# EAGLE design tsshield (EAGLE 6.4)
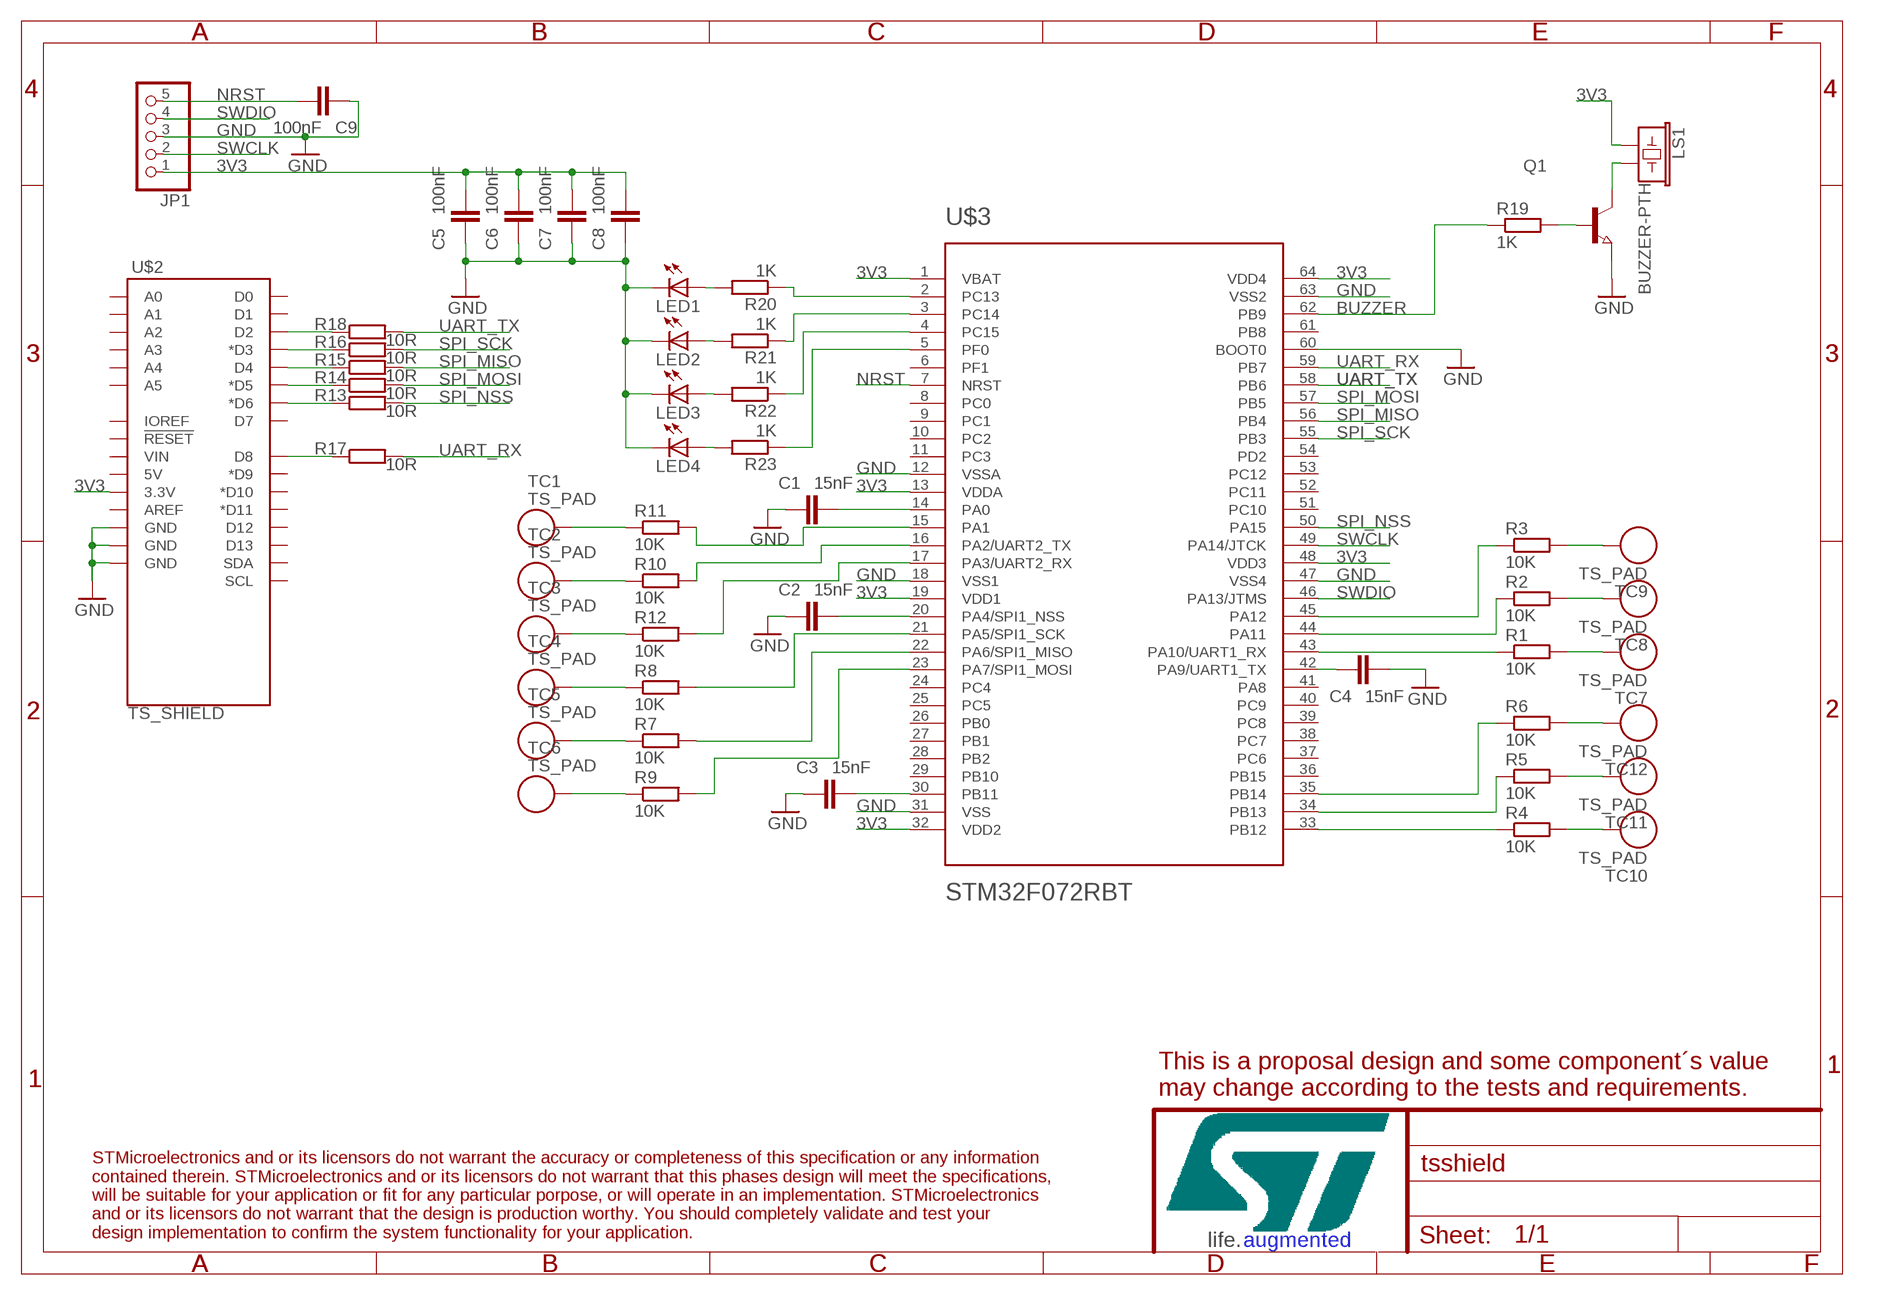
[diagram p0: schematic, sheet 1]

## Parts
C1  15nF  CC0603  [C0603]
C2  15nF  CC0603  [C0603]
C3  15nF  CC0603  [C0603]
C4  15nF  CC0603  [C0603]
C5  100nF  CC0603  [C0603]
C6  100nF  CC0603  [C0603]
C7  100nF  CC0603  [C0603]
C8  100nF  CC0603  [C0603]
C9  100nF  CC0603  [C0603]
JP1  PINHD-1X5  [1X05]
LED1  LED_E  [LED_1206]
LED2  LED_E  [LED_1206]
LED3  LED_E  [LED_1206]
LED4  LED_E  [LED_1206]
LS1  BUZZER-PTH  [BUZZER-12MM]
Q1  NPN-TRANSISTOR_SOT23  [SOT23]
R1  10K  RR0603  [R0603]
R2  10K  RR0603  [R0603]
R3  10K  RR0603  [R0603]
R4  10K  RR0603  [R0603]
R5  10K  RR0603  [R0603]
R6  10K  RR0603  [R0603]
R7  10K  RR0603  [R0603]
R8  10K  RR0603  [R0603]
R9  10K  RR0603  [R0603]
R10  10K  RR0603  [R0603]
R11  10K  RR0603  [R0603]
R12  10K  RR0603  [R0603]
R13  10R  RR0603  [R0603]
R14  10R  RR0603  [R0603]
R15  10R  RR0603  [R0603]
R16  10R  RR0603  [R0603]
R17  10R  RR0603  [R0603]
R18  10R  RR0603  [R0603]
R19  1K  RR0603  [R0603]
R20  1K  RR0603  [R0603]
R21  1K  RR0603  [R0603]
R22  1K  RR0603  [R0603]
R23  1K  RR0603  [R0603]
TC1  TS_PAD  [TS_PAD]
TC2  TS_PAD  [TS_PAD]
TC3  TS_PAD  [TS_PAD]
TC4  TS_PAD  [TS_PAD]
TC5  TS_PAD  [TS_PAD]
TC6  TS_PAD  [TS_PAD]
TC7  TS_PAD  [TS_PAD]
TC8  TS_PAD  [TS_PAD]
TC9  TS_PAD  [TS_PAD]
TC10  TS_PAD  [TS_PAD]
TC11  TS_PAD  [TS_PAD]
TC12  TS_PAD  [TS_PAD]
U$2  TS_SHIELD  [TS_SHIELD]
U$3  STM32F072RBT  [TQFP64]

## Nets
3V3: C5.1 C6.1 C7.1 C8.1 JP1.1 LS1.+ U$2.3.3V U$3.1(VBAT) U$3.13(VDDA) U$3.19(VDD1) U$3.32(VDD2) U$3.48(VDD3) U$3.64(VDD4)
BUZZER: R19.1 U$3.62(PB9)
GND: C1.2 C2.2 C3.2 C4.1 C5.2 C6.2 C7.2 C8.2 C9.2 JP1.3 LED1.C LED2.C LED3.C LED4.C Q1.2(E) U$2.GND@1(GND) U$2.GND@2(GND) U$2.GND@3(GND) U$3.12(VSSA) U$3.18(VSS1) U$3.31(VSS) U$3.47(VSS4) U$3.60(BOOT0) U$3.63(VSS2)
N$1: C1.1 U$3.14(PA0)
N$2: C2.1 U$3.20(PA4/SPI1_NSS)
N$3: C3.1 U$3.30(PB11)
N$4: C4.2 U$3.42(PA9/UART1_TX)
N$5: R11.2 U$3.15(PA1)
N$6: R10.2 U$3.16(PA2/UART2_TX)
N$7: R12.2 U$3.17(PA3/UART2_RX)
N$8: R8.2 U$3.21(PA5/SPI1_SCK)
N$9: R7.1 TC5.1
N$10: R9.2 U$3.23(PA7/SPI1_MOSI)
N$11: R4.1 U$3.33(PB12)
N$12: R5.1 U$3.34(PB13)
N$13: R6.1 U$3.35(PB14)
N$14: R1.1 U$3.43(PA10/UART1_RX)
N$15: R2.1 U$3.44(PA11)
N$16: R3.1 U$3.45(PA12)
N$17: R15.1 U$2.D4
N$18: R14.1 U$2.D5(*D5)
N$19: R13.1 U$2.D6(*D6)
N$20: R16.1 U$2.D3(*D3)
N$21: R11.1 TC1.1
N$22: R10.1 TC2.1
N$23: R12.1 TC3.1
N$24: R8.1 TC4.1
N$25: R7.2 U$3.22(PA6/SPI1_MISO)
N$26: R9.1 TC6.1
N$27: R4.2 TC10.1
N$28: R5.2 TC11.1
N$29: R6.2 TC12.1
N$30: R1.2 TC7.1
N$31: R2.2 TC8.1
N$32: R3.2 TC9.1
N$37: R18.1 U$2.D2
N$40: R17.1 U$2.D8
N$41: LS1.- Q1.3(C)
N$42: Q1.1(B) R19.2
N$43: LED2.A R21.2
N$44: LED1.A R20.2
N$45: LED3.A R22.2
N$46: LED4.A R23.2
N$47: R20.1 U$3.2(PC13)
N$48: R21.1 U$3.3(PC14)
N$50: R22.1 U$3.4(PC15)
N$51: R23.1 U$3.5(PF0)
NRST: C9.1 JP1.5 U$3.7(NRST)
SPI_MISO: R15.2 U$3.56(PB4)
SPI_MOSI: R14.2 U$3.57(PB5)
SPI_NSS: R13.2 U$3.50(PA15)
SPI_SCK: R16.2 U$3.55(PB3)
SWCLK: JP1.2 U$3.49(PA14/JTCK)
SWDIO: JP1.4 U$3.46(PA13/JTMS)
UART_RX: R17.2 U$3.59(PB7)
UART_TX: R18.2 U$3.58(PB6)
Unconnected: U$2.5V U$2.A0 U$2.A1 U$2.A2 U$2.A3 U$2.A4 U$2.A5 U$2.AREF U$2.D0 U$2.D1 U$2.D7 U$2.D9(*D9) U$2.D10(*D10) U$2.D11(*D11) U$2.D12 U$2.D13 U$2.IOREF U$2.RESET@1(!RESET!) U$2.SCL U$2.SDA U$2.VIN U$3.6(PF1) U$3.8(PC0) U$3.9(PC1) U$3.10(PC2) U$3.11(PC3) U$3.24(PC4) U$3.25(PC5) U$3.26(PB0) U$3.27(PB1) U$3.28(PB2) U$3.29(PB10) U$3.36(PB15) U$3.37(PC6) U$3.38(PC7) U$3.39(PC8) U$3.40(PC9) U$3.41(PA8) U$3.51(PC10) U$3.52(PC11) U$3.53(PC12) U$3.54(PD2) U$3.61(PB8)

## Library data of the parts
C1-C9 = eagle-ltspice:C: CAPACITOR, European symbol; SPICEMODEL: NONE; SPICEPREFIX: C
JP1 = pinhead:PINHD-1X5: PIN HEADER
LED1-LED4 = eagle-ltspice:LED_E: LED Source: http://www.osram.convergy.de Source: www.luxeon.com Source: www.kingbright.com; SPICEMODEL: NONE; SPICEPREFIX: D; SPICETYPE: diode
LS1 = SparkFun-Electromechanical:BUZZER: Buzzer Small round buzzers that operate around the audible 2kHz range. You can use these as speakers to create simple music or user interfaces. Variant Overview: PTH - Mini Speaker - PC Mount 12mm 2.048kHz <https://www.sparkfun.com/products/7950> PTH_KIT - Mini Speaker - PC Mount 12mm 2.048kHz <https://www.sparkfun.com/products/7950> KIT simplifies soldering by adding stop mask to one side of the pads. PTH_NO_SILK - Mini Speaker - PC Mount 12mm 2.048kHz <https://www.sparkfun.com/products/7950> No silkscreen indicator of buzzer outline. PTH_KIT_NO_SILK - Mini Speaker - PC Mount 12mm 2.048kHz <https://www.sparkfun.com/products/7950> KIT package w/o silkscreen SMD - Buzzer Audio Magnetic (CCV-084B16) SMD buzzer used on, e.g. the LilyPad Buzzer <https://www.sparkfun.com/products/8463> and RFID USB Reader <https://www.sparkfun.com/products/9963>. SMD_KIT - Buzzer Audio Magnetic (CCV-084B16) SMD Buzzer with elongated pins to make soldering easier. Used on the SparkFun Simon Says - Surface Mount Soldering Kit <https://www.sparkfun.com/products/10935>.; PROD_ID: COMP-08253; SF_SKU: COM-07950
Q1 = semicon-smd-ipc:NPN-TRANSISTOR_: NPN TRANSISTOR
R1-R23 = eagle-ltspice:R: RESISTOR, European symbol; SPICEMODEL: NONE; SPICEPREFIX: R
TC1-TC12 = GPRC_Misc:TS_PAD
U$2 = SparkFun-Boards:TS_SHIELD
U$3 = SparkFun-IC-Microcontroller:STM32F072RBT

## Board
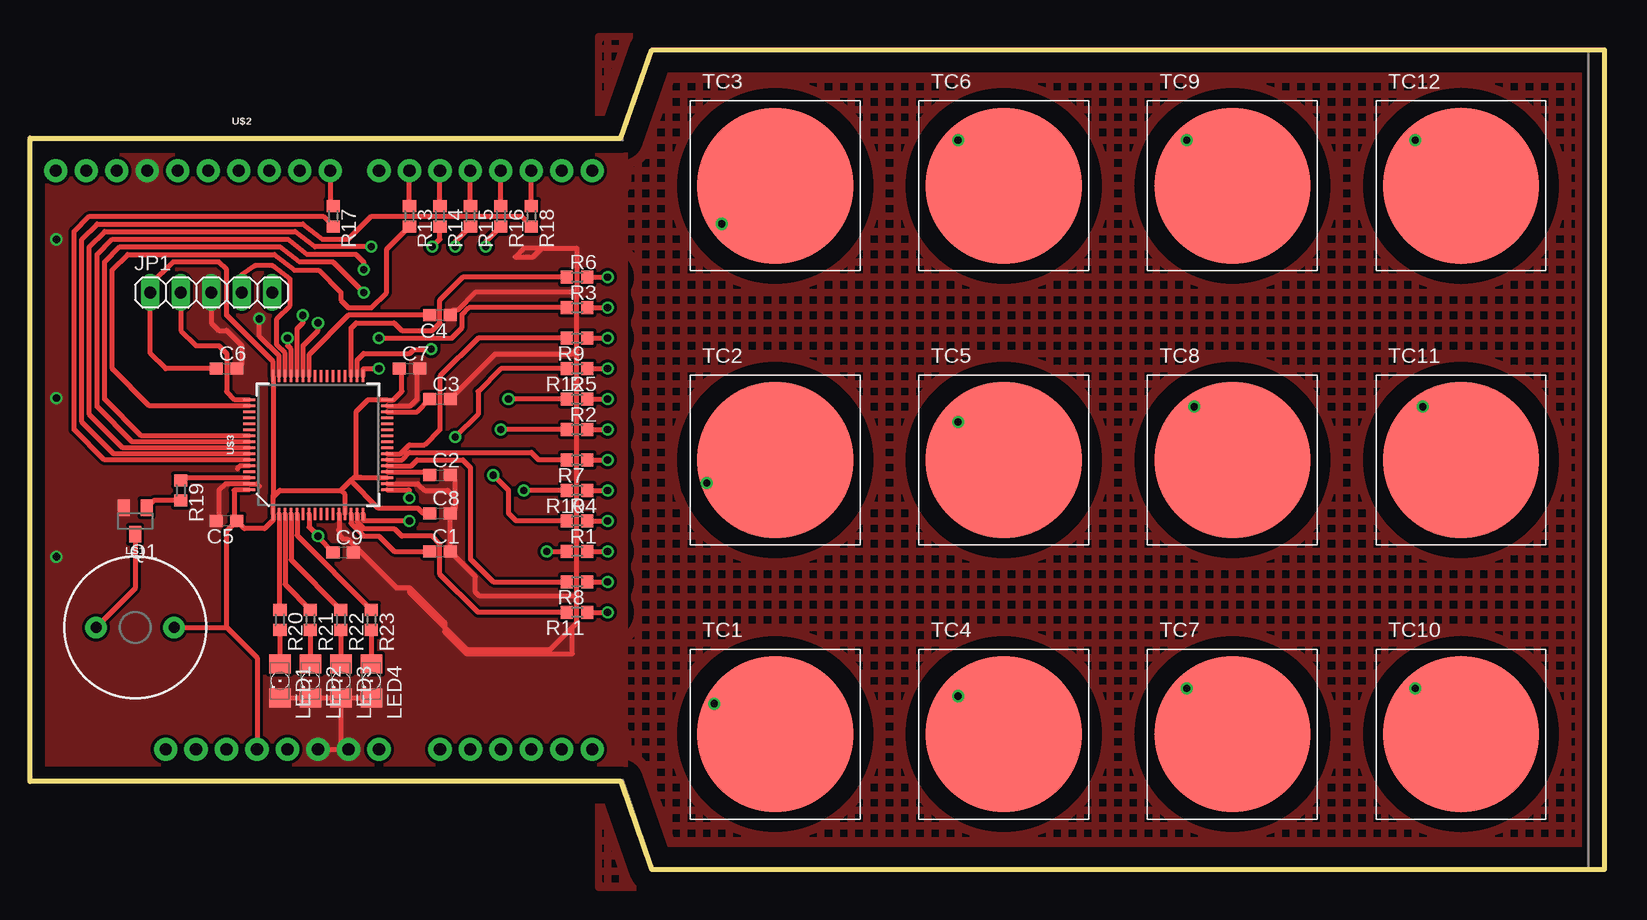
[diagram p1: board, top side]
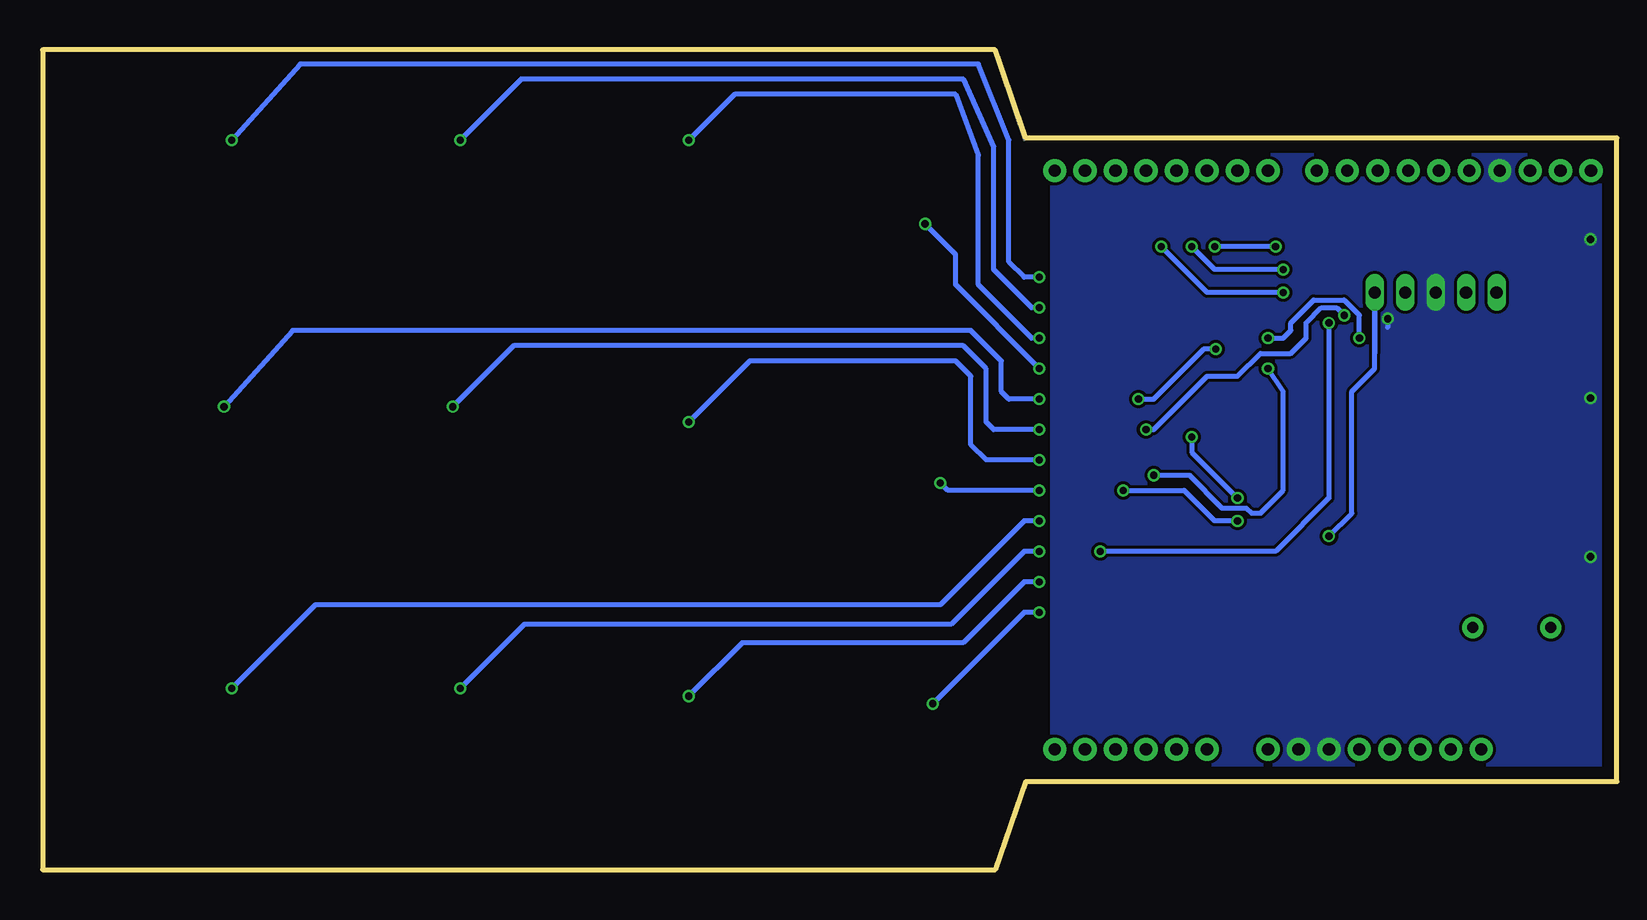
[diagram p2: board, bottom side, seen from below]

Size 131.2 x 68.35 mm. Coordinates in mm from the lower left corner, seen from the top.
Outline: 0,61.01 49.24,61.01 51.82,68.35 131.2,68.35 131.2,0 51.82,0 49.24,7.35 0,7.35 0,61.01
Copper layers (1*16): Top 0.035mm / dielectric 1.5mm / Bottom 0.035mm
Design rules "default": minimum track width 10mil, minimum drill 24mil, track to track 8mil, track to pad 8mil, pad to pad 8mil, via to via 8mil, smd to smd 8mil, copper to edge 40mil, drill to drill 8mil, minimum pad ring 10mil, minimum via ring 8mil, stop-mask expansion 4mil, vias tented up to drill 0mil, thermal gap 10mil

### Footprints (pad centres in the part's own frame; a part is rotated, then mirrored left to right if it is on the bottom)
C0603 = smd 1.1 x 1: 1 -0.85,0; 2 0.85,0
1X05 = drill 1.016 long: 1 -5.08,0; 2 -2.54,0; 3 0,0; 4 2.54,0; 5 5.08,0
LED_1206 = smd 1.6 x 1.803: A -1.422,0; C 1.422,0
BUZZER-12MM = drill 0.9 pad 1.778: + 3.25,0; - -3.25,0
SOT23 = smd 1 x 1.4: 1 -0.95,-1.1; 2 0.95,-1.1; 3 0,1.1
R0603 = smd 1 x 1.1: 1 -0.85,0; 2 0.85,0
TS_PAD = smd 13 x 13: 1 0,0
TS_SHIELD = drill 1.016 pad 1.93: 3.3V 19.05,2.54; 5V 21.59,2.54; A0 34.29,2.54; A1 36.83,2.54; A2 39.37,2.54; A3 41.91,2.54; A4 44.45,2.54; A5 46.99,2.54; AREF 7.366,50.8; D0 46.99,50.8; D1 44.45,50.8; D2 41.91,50.8; D3 39.37,50.8; D4 36.83,50.8; D5 34.29,50.8; D6 31.75,50.8; D7 29.21,50.8; D8 25.146,50.8; D9 22.606,50.8; D10 20.066,50.8; D11 17.526,50.8; D12 14.986,50.8; D13 12.446,50.8; GND@1 24.13,2.54; GND@2 26.67,2.54; GND@3 9.906,50.8; IOREF 13.97,2.54; NC 11.43,2.54; RESET@1 16.51,2.54; SCL 2.286,50.8; SDA 4.826,50.8; VIN 29.21,2.54
TQFP64 = smd 0.22 x 1: 1 -3.75,-5.75; 2 -3.25,-5.75; 3 -2.75,-5.75; 4 -2.25,-5.75; 5 -1.75,-5.75; 6 -1.25,-5.75; 7 -0.75,-5.75; 8 -0.25,-5.75; 9 0.25,-5.75; 10 0.75,-5.75; 11 1.25,-5.75; 12 1.75,-5.75; 13 2.25,-5.75; 14 2.75,-5.75; 15 3.25,-5.75; 16 3.75,-5.75; 33 3.75,5.75; 34 3.25,5.75; 35 2.75,5.75; 36 2.25,5.75; 37 1.75,5.75; 38 1.25,5.75; 39 0.75,5.75; 40 0.25,5.75; 41 -0.25,5.75; 42 -0.75,5.75; 43 -1.25,5.75; 44 -1.75,5.75; 45 -2.25,5.75; 46 -2.75,5.75; 47 -3.25,5.75; 48 -3.75,5.75 | smd 1 x 0.22: 17 5.75,-3.75; 18 5.75,-3.25; 19 5.75,-2.75; 20 5.75,-2.25; 21 5.75,-1.75; 22 5.75,-1.25; 23 5.75,-0.75; 24 5.75,-0.25; 25 5.75,0.25; 26 5.75,0.75; 27 5.75,1.25; 28 5.75,1.75; 29 5.75,2.25; 30 5.75,2.75; 31 5.75,3.25; 32 5.75,3.75; 49 -5.75,3.75; 50 -5.75,3.25; 51 -5.75,2.75; 52 -5.75,2.25; 53 -5.75,1.75; 54 -5.75,1.25; 55 -5.75,0.75; 56 -5.75,0.25; 57 -5.75,-0.25; 58 -5.75,-0.75; 59 -5.75,-1.25; 60 -5.75,-1.75; 61 -5.75,-2.25; 62 -5.75,-2.75; 63 -5.75,-3.25; 64 -5.75,-3.75

### Placement (x,y rotation side)
C1  34.16,26.54 0 top
C2  34.16,32.89 0 top
C3  34.16,39.24 0 top
C4  34.16,46.23 180 top
C5  16.38,29.08 180 top
C6  16.38,41.78 0 top
C7  31.62,41.78 0 top
C8  34.16,29.72 0 top
C9  26.09,26.46 0 top
JP1  15.11,48.13 0 top
LED1  20.82,15.75 270 top
LED2  23.37,15.75 270 top
LED3  25.91,15.75 270 top
LED4  28.45,15.75 270 top
LS1  8.76,20.19 0 top
Q1  8.76,29.08 180 top
R1  45.59,26.54 0 top
R2  45.59,36.7 0 top
R3  45.59,46.86 0 top
R4  45.59,29.08 0 top
R5  45.59,39.24 0 top
R6  45.59,49.4 0 top
R7  45.59,34.16 180 top
R8  45.59,24 180 top
R9  45.59,44.32 180 top
R10  45.59,31.62 180 top
R11  45.59,21.46 180 top
R12  45.59,41.78 180 top
R13  31.62,54.48 270 top
R14  34.16,54.48 270 top
R15  36.7,54.48 270 top
R16  39.24,54.48 270 top
R17  25.27,54.48 270 top
R18  41.78,54.48 270 top
R19  12.57,31.62 270 top
R20  20.82,20.82 270 top
R21  23.37,20.82 270 top
R22  25.91,20.82 270 top
R23  28.45,20.82 270 top
TC1  62.1,11.3 0 top
TC2  62.1,34.16 0 top
TC3  62.1,57.02 0 top
TC4  81.15,11.3 0 top
TC5  81.15,34.16 0 top
TC6  81.15,57.02 0 top
TC7  100.2,11.3 0 top
TC8  100.2,34.16 0 top
TC9  100.2,57.02 0 top
TC10  119.25,11.3 0 top
TC11  119.25,34.16 0 top
TC12  119.25,57.02 0 top
U$2  -0.13,7.49 0 top
U$3  24,35.43 0 top

### Tracks (layer width: path | path; a pad name or v marks a point on that pad's centre or on a via)
3V3
  Top 0.406: C5.1 17.87,28.45 19.55,28.45 20.25,29.14 U$3.1 20.25,31.05 20.33,31.12 | U$3.64 17.07,31.68 17.02,31.62 17.02,29.3 C5.1 | 16.38,20.19 18.92,17.65 U$2.3.3V | LS1.+ 16.38,20.19 | 16.38,20.19 16.38,28.23 C5.1 | C6.1 11.3,41.78 10.03,43.05 JP1.1 10.03,48.77 11.94,50.67 15.75,50.67 16.38,50.04 16.38,46.23 20.25,42.36 U$3.48 20.25,31.2 20.33,31.12 | C7.1 30.98,41.56 30.98,39.88 30.29,39.18 U$3.32 28.16,39.18 27.2,38.22 27.2,32.71 27.56,32.71 27.59,32.68 U$3.19 26.97,32.68 26.73,32.44 | 20.33,31.12 20.82,31.62 25.91,31.62 | U$3.13 26.25,31.27 25.91,31.62 | 26.73,32.44 25.91,31.62 | C8.1 32.76,29.72 32.34,30.13 29.03,30.13 26.73,32.44
BUZZER
  Top 0.406: U$3.62 12.78,32.68 R19.1
GND  (via drill 0.6)
  Top 0.406: C5.2 15.75,29.3 15.75,31.62 16.3,32.18 U$3.63 18.9,32.18 19.11,31.97 | JP1.3 15.11,45.59 15.75,44.95 16.38,44.95 17.65,43.69 17.65,42.2 C6.2 | U$3.31 31.7,38.68 32.26,39.24 32.26,41.56 C7.2 | U$3.18 32.33,32.18 32.89,31.62 34.8,31.62 35.43,30.98 | 34.8,32.68 C2.2 35.43,32.47 35.43,30.98 | 35.43,30.98 35.43,30.35 | 35.43,30.35 35.43,30.13 C8.2 | C8.2 35.01,29.93 35.43,30.35 | C8.2 C1.2 37.12,24.43 37.12,23.15 37.48,22.79 45.57,22.79 | LED1.C LED2.C LED3.C | LED3.C LED4.C | U$2.GND@1 U$2.GND@2 25.91,10.66 LED3.C | 25.73,28.3 25.75,28.32 U$3.12 25.75,27.91 26.09,27.56 26.46,27.56 30.5,23.52 31.61,23.52 | 31.61,23.52 34.55,20.58 34.55,19.85 36.38,18.01 45.2,18.01 45.2,20.21 | 45.2,20.21 45.57,20.58 45.57,22.79 | 45.57,22.79 45.57,43 45.2,43 | C3.2 38.77,43 45.2,43 | 45.2,43 45.57,43.37 45.57,48.14 | 42.63,51.82 41.16,51.82 40.43,51.08 41.9,51.08 42.63,51.82 | 42.63,51.82 45.57,51.82 45.57,48.14 | 45.57,48.14 37.12,48.14 35.65,46.67 35.28,46.67 34.91,46.3 | 31.61,23.52 31.61,23.15 36.38,18.38 43.37,18.38 45.2,20.21 | U$3.47 20.75,42.83 19.11,44.47 v19.11,45.94 | U$3.60 17.51,33.68 17.27,33.44
  Bottom 0.406: v19.11,45.94 19.11,45.2
  other vias: 2.21,52.55 2.21,39.32 2.21,26.09
  pour Top (isolate 0.254, no thermals): 0,60.64 49.61,60.64 49.61,7.72 0,7.72
  pour Bottom (isolate 0.254, no thermals): 0,60.64 47.04,60.64 47.04,7.72 0,7.72
  pour Top (isolate 1.676, no thermals, hatched): 47.41,69.46 131.56,69.46 131.56,-1.47 47.41,-1.47
N$1
  Top 0.406: U$3.14 26.75,28.87 27.81,27.81 29.08,27.81 30.35,26.54 C1.1
N$2
  Top 0.406: U$3.20 33.02,33.18 C2.1
N$3
  Top 0.406: U$3.30 32.25,38.18 C3.1
N$4
  Top 0.406: U$3.42 23.25,42.94 26.54,46.23 C4.2
N$5
  Top 0.406: R11.2 37.34,21.46 34.16,24.63 34.16,27.18 33.52,27.81 30.98,27.81 30.35,28.45 27.81,28.45 27.25,29.01 U$3.15
N$6  (via drill 0.6)
  Top 0.406: R10.2 v41.15,31.62 | v31.62,29.08 27.81,29.08 27.75,29.14 U$3.16
  Bottom 0.406: v41.15,31.62 36.06,31.62 33.52,29.08 v31.62,29.08
N$7  (via drill 0.6)
  Top 0.406: R12.2 39.24,41.78 37.34,39.88 37.34,37.97 v35.43,36.06 | v31.62,30.98 31.62,31.62 31.56,31.68 U$3.17
  Bottom 0.406: v35.43,36.06 35.43,34.8 v31.62,30.98
N$8
  Top 0.406: U$3.21 31.77,33.68 32.26,34.16 36.06,34.16 36.7,33.52 36.7,25.91 38.61,24 R8.2
N$9  (via drill 0.6)
  Top 0.406: R7.1 v48.13,34.16 | v77.34,37.34 77.97,37.34 TC5.1
  Bottom 0.406: v48.13,34.16 52.58,34.16 53.85,35.43 53.85,41.15 55.12,42.41 72.26,42.41 v77.34,37.34
N$10
  Top 0.406: R9.2 37.34,44.32 34.16,41.15 34.16,36.7 32.89,35.43 31.62,35.43 30.87,34.68 U$3.23
N$11  (via drill 0.6)
  Top 0.406: R4.1 40.51,29.08 39.88,29.72 39.88,31.62 v38.61,32.89 | U$3.33 27.75,41.72 27.81,41.78 v29.08,41.78
  Bottom 0.406: v38.61,32.89 35.65,32.89 32.89,30.13 30.87,30.13 30.45,29.72 29.72,29.72 27.81,31.62 27.81,39.88 v29.08,41.78
N$12  (via drill 0.6)
  Top 0.406: R5.1 v39.88,39.24 | U$3.34 27.25,42.49 27.81,43.05 31.66,43.05 31.97,43.37 33.37,43.37 v33.43,43.42
  Bottom 0.406: v39.88,39.24 38.61,39.24 34.43,43.42 v33.43,43.42
N$13
  Top 0.406: R6.1 36.06,49.4 34.16,47.49 34.16,45.59 33.52,44.95 30.98,44.95 30.35,45.59 27.18,45.59 26.75,45.16 U$3.35
N$14  (via drill 0.6)
  Top 0.406: U$3.43 22.75,43.7 24,44.95 v24,45.59 | v43.05,26.54 R1.1
  Bottom 0.406: v24,45.59 24,30.98 28.45,26.54 v43.05,26.54
N$15  (via drill 0.6)
  Top 0.406: R2.1 v39.24,36.7 | v22.73,46.23 22.73,45.59 22.25,45.11 U$3.44
  Bottom 0.406: v39.24,36.7 38.61,36.7 34.16,41.15 31.62,41.15 29.72,43.05 27.18,43.05 25.91,44.32 25.91,45.59 24.63,46.86 23.37,46.86 v22.73,46.23
N$16  (via drill 0.6)
  Top 0.406: R3.1 36.57,46.86 36.02,46.3 36.02,45.2 35.13,44.32 v29.08,44.32 | v21.46,44.32 21.46,43.69 21.75,43.4 U$3.45
  Bottom 0.406: v21.46,44.32 21.46,46.23 22.73,47.49 25.27,47.49 27.18,45.59 27.18,44.95 27.81,44.32 v29.08,44.32
N$17
  Top 0.406: R15.1 U$2.D4
N$18
  Top 0.406: R14.1 U$2.D5
N$19
  Top 0.406: R13.1 U$2.D6
N$20
  Top 0.406: R16.1 U$2.D3
N$21  (via drill 0.6)
  Top 0.406: R11.1 v48.13,21.46 | v57.02,13.84 59.56,13.84 TC1.1
  Bottom 0.406: v48.13,21.46 49.4,21.46 v57.02,13.84
N$22  (via drill 0.6)
  Top 0.406: R10.1 v48.13,31.62 | v56.38,32.26 60.2,32.26 TC2.1
  Bottom 0.406: v48.13,31.62 55.75,31.62 v56.38,32.26
N$23  (via drill 0.6)
  Top 0.406: R12.1 v48.13,41.78 | v57.65,53.85 58.93,53.85 TC3.1
  Bottom 0.406: v48.13,41.78 55.12,48.77 55.12,51.3 v57.65,53.85
N$24  (via drill 0.6)
  Top 0.406: R8.1 v48.13,24 | v77.34,14.48 77.97,14.48 TC4.1
  Bottom 0.406: v48.13,24 49.4,24 54.48,18.92 72.9,18.92 v77.34,14.48
N$25
  Top 0.406: R7.2 42.41,34.16 41.78,34.8 31.62,34.8 31.01,34.18 U$3.22
N$26  (via drill 0.6)
  Top 0.406: R9.1 v48.13,44.32 | v77.34,60.83 TC6.1
  Bottom 0.406: v48.13,44.32 48.77,44.32 53.21,48.77 53.21,59.56 55.12,64.64 73.53,64.64 v77.34,60.83
N$27  (via drill 0.6)
  Top 0.406: R4.2 v48.13,29.08 | v115.44,15.11 TC10.1
  Bottom 0.406: v48.13,29.08 49.4,29.08 56.38,22.09 108.46,22.09 v115.44,15.11
N$28  (via drill 0.6)
  Top 0.406: R5.2 v48.13,39.24 | v116.07,38.61 116.07,37.34 TC11.1
  Bottom 0.406: v48.13,39.24 50.67,39.24 51.3,39.88 51.3,42.41 53.85,44.95 110.36,44.95 v116.07,38.61
N$29  (via drill 0.6)
  Top 0.406: R6.2 v48.13,49.4 | v115.44,60.83 TC12.1
  Bottom 0.406: v48.13,49.4 49.4,49.4 50.67,50.67 50.67,60.83 53.21,67.18 109.72,67.18 v115.44,60.83
N$30  (via drill 0.6)
  Top 0.406: R1.2 v48.13,26.54 | v96.39,15.11 TC7.1
  Bottom 0.406: v48.13,26.54 49.4,26.54 55.48,20.46 91.04,20.46 v96.39,15.11
N$31  (via drill 0.6)
  Top 0.406: R2.2 v48.13,36.7 | v97.03,38.61 97.03,37.34 TC8.1
  Bottom 0.406: v48.13,36.7 51.94,36.7 52.58,37.34 52.58,41.78 54.48,43.69 91.94,43.69 v97.03,38.61
N$32  (via drill 0.6)
  Top 0.406: R3.2 v48.13,46.86 | v96.39,60.83 TC9.1
  Bottom 0.406: v48.13,46.86 48.77,46.86 51.94,50.04 51.94,60.2 54.48,65.91 91.31,65.91 v96.39,60.83
N$37
  Top 0.406: R18.1 U$2.D2
N$40
  Top 0.406: U$2.D8 25.02,55.58 R17.1
N$41
  Top 0.406: Q1.3 8.76,23.44 LS1.-
N$42
  Top 0.406: R19.2 10.3,30.77 Q1.1
N$43
  Top 0.406: R21.2 LED2.A
N$44
  Top 0.406: R20.2 LED1.A
N$45
  Top 0.406: R22.2 LED3.A
N$46
  Top 0.406: R23.2 LED4.A
N$47
  Top 0.406: U$3.2 20.75,21.75 R20.1
N$48
  Top 0.406: U$3.3 21.25,23.79 R21.1
N$50
  Top 0.406: U$3.4 21.75,25.83 R22.1
N$51
  Top 0.406: U$3.5 22.25,27.87 R23.1
NRST  (via drill 0.6)
  Top 0.406: U$3.7 23.25,28.56 v24,27.81 24,27.7 C9.1
  Bottom 0.406: 20.19,43.05 JP1.5 20.19,41.78 22.09,39.88 22.09,29.72 v24,27.81
SPI_MISO  (via drill 0.6)
  Top 0.406: U$3.56 8.51,35.68 5.59,38.61 5.59,51.3 6.86,52.58 21.46,52.58 23.1,51.3 27.18,51.3 27.81,50.67 v27.81,50.04 | v35.43,51.94 35.43,52.36 R15.2
  Bottom 0.406: v27.81,50.04 33.52,50.04 v35.43,51.94
SPI_MOSI  (via drill 0.6)
  Top 0.406: U$3.57 7.74,35.18 4.95,37.97 4.95,51.94 6.22,53.21 22.09,53.21 23.73,51.94 v28.45,51.94 | v33.52,51.94 34.16,52.58 R14.2
  Bottom 0.406: v28.45,51.94 v33.52,51.94
SPI_NSS
  Top 0.406: U$3.50 9.96,38.68 6.86,41.78 6.86,50.04 8.12,51.3 20.36,51.3 22.05,49.98 24.05,49.98 25.91,48.13 25.91,47.49 26.54,46.86 28.45,46.86 29.72,48.13 29.72,51.73 R13.2
SPI_SCK  (via drill 0.6)
  Top 0.406: U$3.55 9.28,36.18 6.22,39.24 6.22,50.67 7.49,51.94 20.82,51.94 22.46,50.67 25.27,50.67 v27.81,48.13 | v37.97,51.94 37.97,52.36 R16.2
  Bottom 0.406: v27.81,48.13 34.16,48.13 v37.97,51.94
SWCLK
  Top 0.406: JP1.2 12.57,44.95 13.84,43.69 15.75,43.69 16.38,43.05 16.38,39.88 17.07,39.18 U$3.49
SWDIO
  Top 0.406: U$3.46 21.25,43.06 20.58,43.73 20.58,45.94 21.68,47.04 21.68,49.24 20.21,50.35 18.74,50.35 17.64,49.61 JP1.4
UART_RX
  Top 0.406: U$3.59 6.2,34.18 3.68,36.7 3.68,53.21 4.95,54.48 24.42,54.48 R17.2
UART_TX
  Top 0.406: U$3.58 6.97,34.68 4.32,37.34 4.32,52.58 5.59,53.85 22.73,53.85 24.37,52.58 26.54,52.58 28.45,54.48 40.93,54.48 R18.2